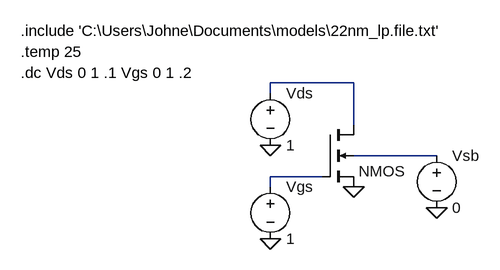
[diagram p0: schematic hw2_q1.asc]
hw2_q1.asc, the LTspice schematic file:
Version 4
SHEET 1 880 680
WIRE 496 16 368 16
WIRE 368 32 368 16
WIRE 496 80 496 16
WIRE 624 128 496 128
WIRE 448 160 368 160
WIRE 368 176 368 160
FLAG 496 176 0
FLAG 368 112 0
FLAG 368 256 0
FLAG 624 208 0
SYMBOL nmos4 448 80 R0
WINDOW 0 56 32 Invisible 2
SYMATTR InstName M1
SYMATTR Value2 l=.03u w=1u
SYMBOL voltage 368 160 R0
WINDOW 123 0 0 Left 2
WINDOW 39 0 0 Left 2
SYMATTR InstName Vgs
SYMATTR Value 1
SYMBOL voltage 368 16 R0
WINDOW 123 0 0 Left 2
WINDOW 39 0 0 Left 2
SYMATTR InstName Vds
SYMATTR Value 1
SYMBOL voltage 624 112 R0
WINDOW 123 0 0 Left 2
WINDOW 39 0 0 Left 2
SYMATTR InstName Vsb
SYMATTR Value 0
TEXT -16 -64 Left 2 !.include 'C:\\Users\\Johne\\Documents\\models\\22nm_lp.file.txt'
TEXT -16 0 Left 2 !.dc Vds 0 1 .1 Vgs 0 1 .2
TEXT -16 -32 Left 2 !.temp 25

The netlist it stands for:
* hw2_q1.asc
M1 N001 N003 0 N002 NMOS l=.03u w=1u
Vgs N003 0 1
Vds N001 0 1
Vsb N002 0 0
.model NMOS NMOS
.model PMOS PMOS
.lib standard.mos
.include 'C:\Users\Johne\Documents\models\22nm_lp.file.txt'
.dc Vds 0 1 .1 Vgs 0 1 .2
.temp 25
.backanno
.end